# EAGLE schematic transceiver_and_pulse_generators (EAGLE 9.1.3)

## Sheet 1 of 2
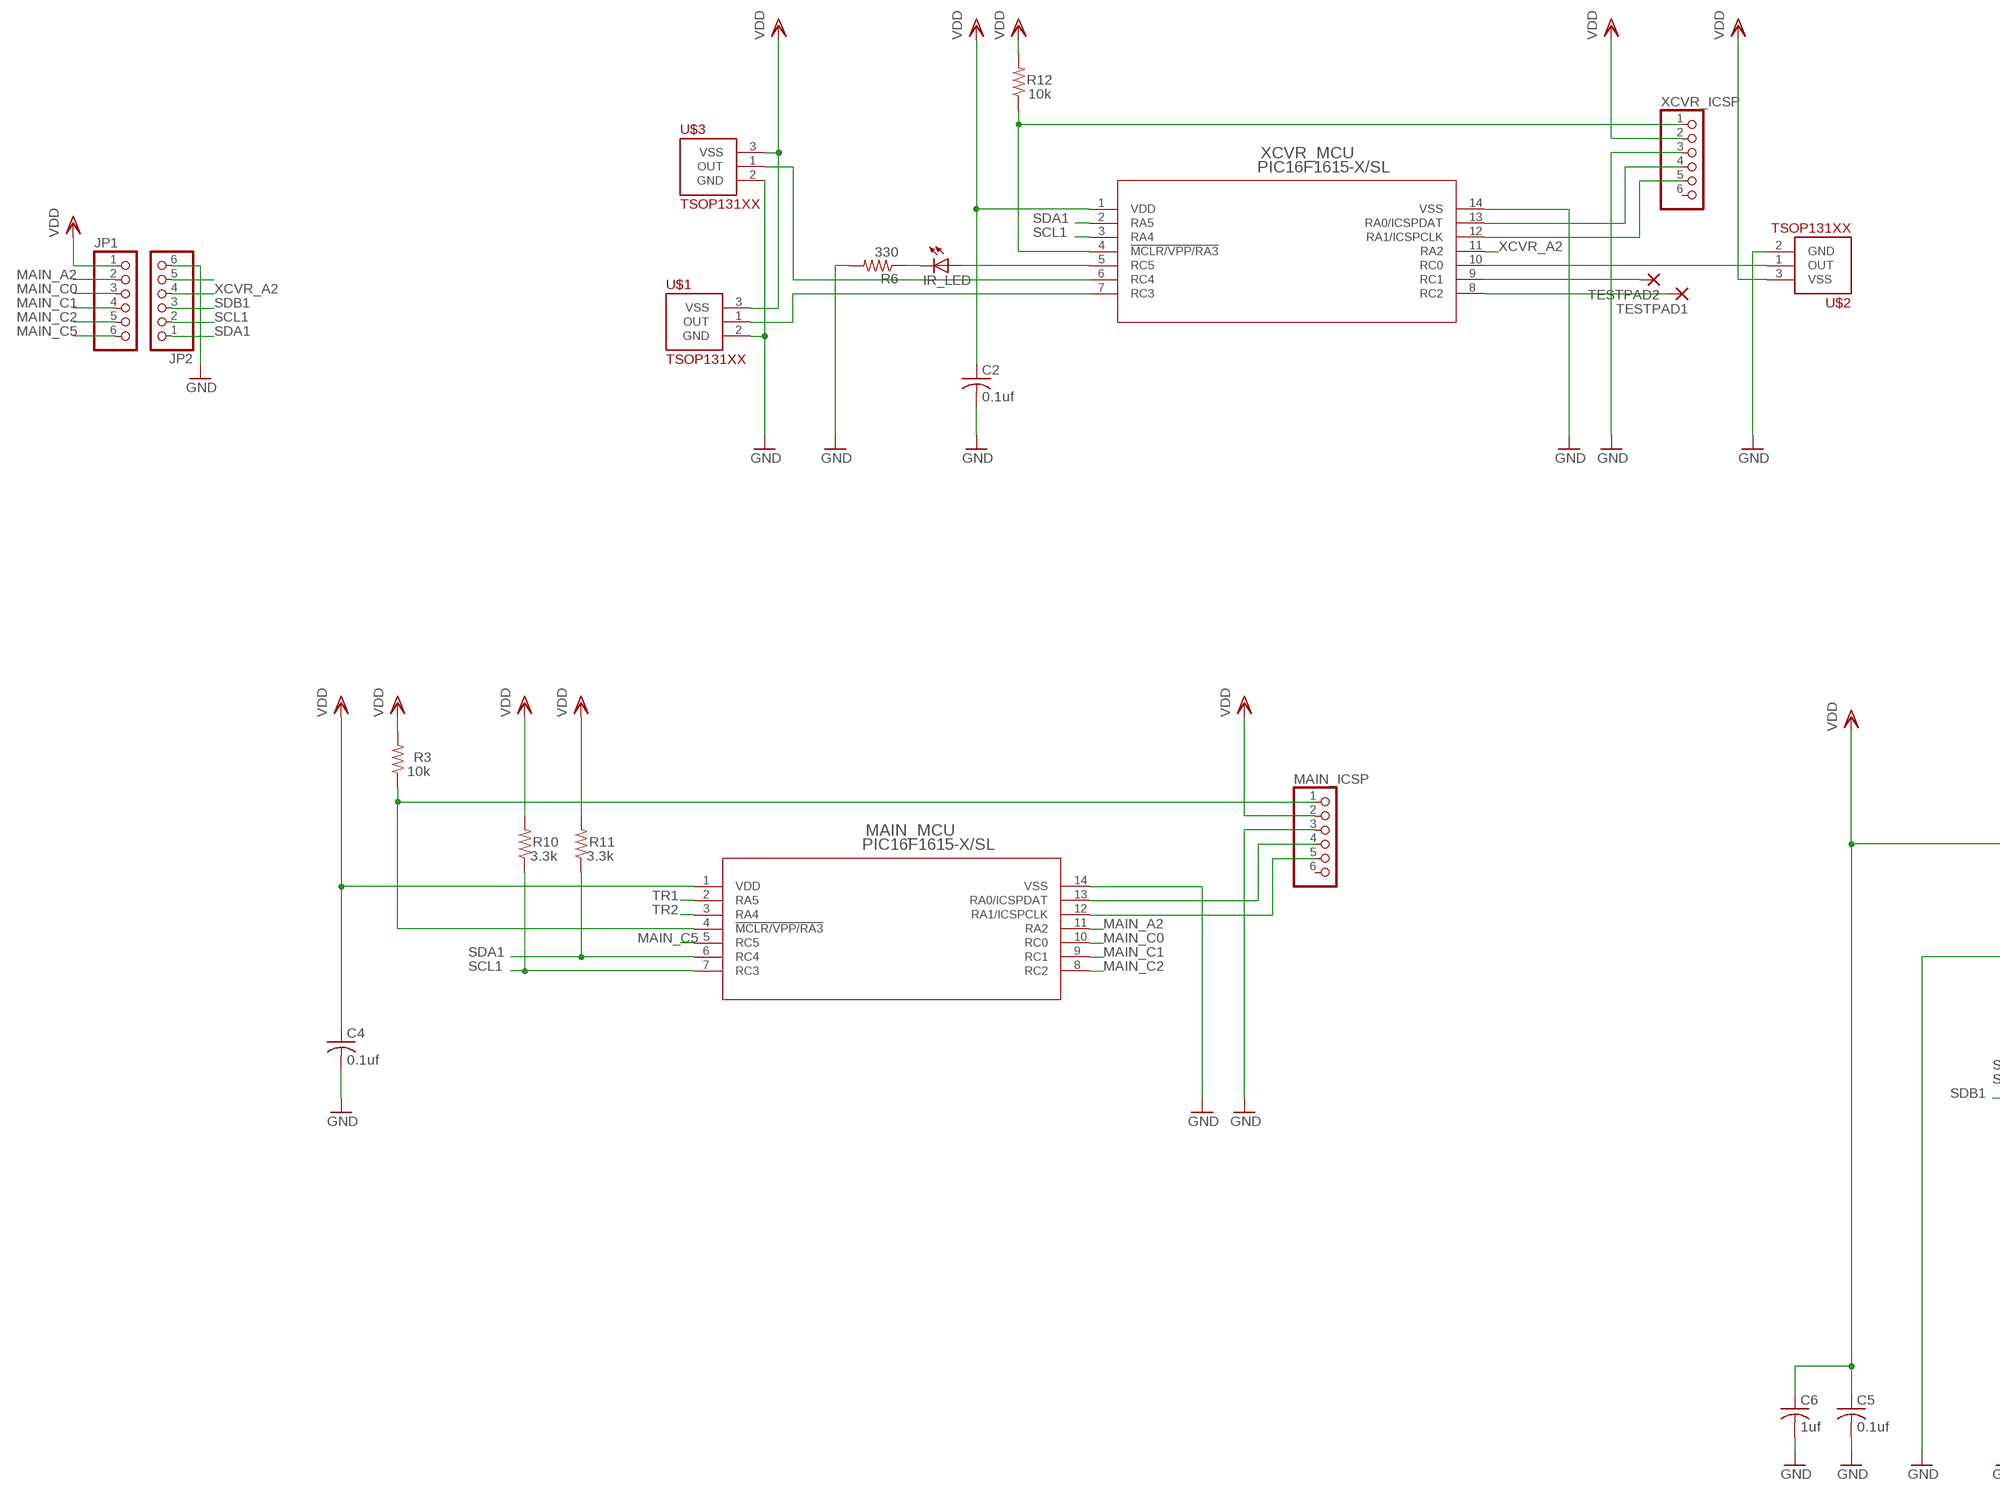
[diagram p0: schematic, sheet 1, part 1 of 2]
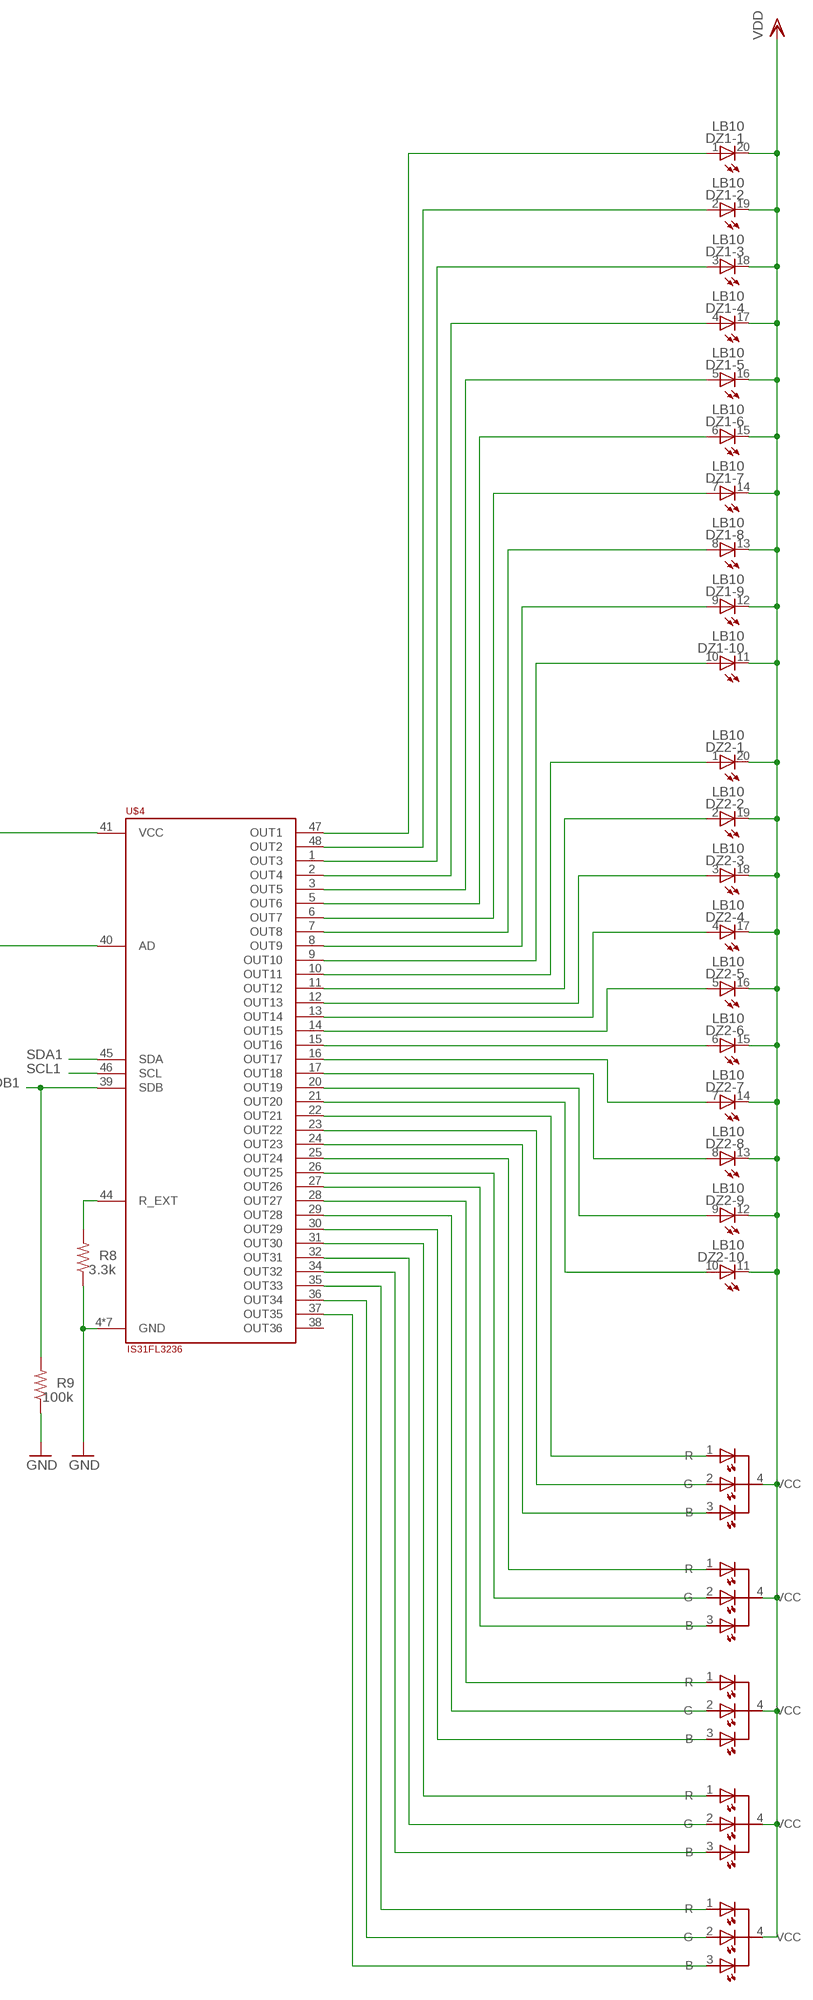
[diagram p1: schematic, sheet 1, part 2 of 2]

### Parts
C2  0.1uf  C-USC0603  [C0603]
C4  0.1uf  C-USC0603  [C0603]
C5  0.1uf  C-USC0603  [C0603]
C6  1uf  C-USC0603  [C0603]
DZ1  LB10  [LB10]
DZ2  LB10  [LB10]
IR_LED  LED5MM  [LED5MM]
JP1  PINHD-1X6  [1X06]
JP2  PINHD-1X6  [1X06]
MAIN_ICSP  PINHD-1X6  [1X06]
MAIN_MCU  PIC16F1615-X/SL  [SOIC14_SL]
R3  10k  R-US_R0603  [R0603]
R6  330  R-US_R0603  [R0603]
R8  3.3k  R-US_R0603  [R0603]
R9  100k  R-US_R0603  [R0603]
R10  3.3k  R-US_R0603  [R0603]
R11  3.3k  R-US_R0603  [R0603]
R12  10k  R-US_R0603  [R0603]
TESTPAD1  SMD2  [SMD1,27-2,54]
TESTPAD2  SMD2  [SMD1,27-2,54]
U$1  TSOP131XX  [TSOP13XXX]
U$2  TSOP131XX  [TSOP13XXX]
U$3  TSOP131XX  [TSOP13XXX]
U$4  IS31FL3236  [IS31FL3236]
U$5  LTST-C19HE1WT  [LTST-C19HE1WT]
U$6  LTST-C19HE1WT  [LTST-C19HE1WT]
U$7  LTST-C19HE1WT  [LTST-C19HE1WT]
U$8  LTST-C19HE1WT  [LTST-C19HE1WT]
U$9  LTST-C19HE1WT  [LTST-C19HE1WT]
XCVR_ICSP  PINHD-1X6  [1X06]
XCVR_MCU  PIC16F1615-X/SL  [SOIC14_SL]

### Nets
GND: C2.2 C4.2 C5.2 C6.2 JP2.6 MAIN_ICSP.3 MAIN_MCU.14(VSS) R6.2 R8.1 R9.1 U$1.2(GND) U$2.2(GND) U$3.2(GND) U$4.4(GND) U$4.18(GND) U$4.19(GND) U$4.33(GND) U$4.40(AD) U$4.42(GND) U$4.43(GND) U$4.49(GND) XCVR_ICSP.3 XCVR_MCU.14(VSS) ; also sheet 2
MAIN_A2: JP1.2 MAIN_MCU.11(RA2)
MAIN_C0: JP1.3 MAIN_MCU.10(RC0)
MAIN_C1: JP1.4 MAIN_MCU.9(RC1)
MAIN_C2: JP1.5 MAIN_MCU.8(RC2)
MAIN_C5: JP1.6 MAIN_MCU.5(RC5)
N$4: XCVR_ICSP.5 XCVR_MCU.12(RA1/ICSPCLK)
N$5: XCVR_ICSP.4 XCVR_MCU.13(RA0/ICSPDAT)
N$6: R12.1 XCVR_ICSP.1 XCVR_MCU.4(!MCLR/VPP/RA3)
N$12: IR_LED.A XCVR_MCU.5(RC5)
N$13: IR_LED.K(C) R6.1
N$14: MAIN_ICSP.1 MAIN_MCU.4(!MCLR/VPP/RA3) R3.1
N$15: MAIN_ICSP.5 MAIN_MCU.12(RA1/ICSPCLK)
N$16: MAIN_ICSP.4 MAIN_MCU.13(RA0/ICSPDAT)
N$17: U$1.1(OUT) XCVR_MCU.7(RC3)
N$18: U$2.1(OUT) XCVR_MCU.10(RC0)
N$19: U$3.1(OUT) XCVR_MCU.6(RC4)
N$20: DZ1.1(-1:A) U$4.47(OUT1)
N$21: DZ1.2(-2:A) U$4.48(OUT2)
N$22: DZ1.3(-3:A) U$4.1(OUT3)
N$23: DZ1.4(-4:A) U$4.2(OUT4)
N$24: DZ1.5(-5:A) U$4.3(OUT5)
N$25: DZ1.6(-6:A) U$4.5(OUT6)
N$26: DZ1.7(-7:A) U$4.6(OUT7)
N$27: DZ1.8(-8:A) U$4.7(OUT8)
N$28: DZ1.9(-9:A) U$4.8(OUT9)
N$29: DZ1.10(-10:A) U$4.9(OUT10)
N$30: DZ2.1(-1:A) U$4.10(OUT11)
N$31: DZ2.2(-2:A) U$4.11(OUT12)
N$32: DZ2.3(-3:A) U$4.12(OUT13)
N$33: DZ2.4(-4:A) U$4.13(OUT14)
N$34: DZ2.5(-5:A) U$4.14(OUT15)
N$35: U$4.37(OUT35) U$9.3(B)
N$36: U$4.36(OUT34) U$9.2(G)
N$37: U$4.35(OUT33) U$9.1(R)
N$38: U$4.34(OUT32) U$8.3(B)
N$39: U$4.32(OUT31) U$8.2(G)
N$40: U$4.31(OUT30) U$8.1(R)
N$41: U$4.30(OUT29) U$7.3(B)
N$42: U$4.29(OUT28) U$7.2(G)
N$43: U$4.28(OUT27) U$7.1(R)
N$44: U$4.27(OUT26) U$6.3(B)
N$45: U$4.26(OUT25) U$6.2(G)
N$46: U$4.25(OUT24) U$6.1(R)
N$47: U$4.24(OUT23) U$5.3(B)
N$48: U$4.23(OUT22) U$5.2(G)
N$49: U$4.22(OUT21) U$5.1(R)
N$50: DZ2.10(-10:A) U$4.21(OUT20)
N$51: DZ2.9(-9:A) U$4.20(OUT19)
N$52: DZ2.8(-8:A) U$4.17(OUT18)
N$53: DZ2.7(-7:A) U$4.16(OUT17)
N$54: DZ2.6(-6:A) U$4.15(OUT16)
N$55: R8.2 U$4.44(R_EXT)
N$62: JP2.5
RESERVED1: TESTPAD1.1(P) XCVR_MCU.8(RC2)
RESERVED2: TESTPAD2.1(P) XCVR_MCU.9(RC1)
SCL1: JP2.2 MAIN_MCU.7(RC3) R10.1 U$4.46(SCL) XCVR_MCU.3(RA4)
SDA1: JP2.1 MAIN_MCU.6(RC4) R11.1 U$4.45(SDA) XCVR_MCU.2(RA5)
SDB1: JP2.3 R9.2 U$4.39(SDB)
TR1: MAIN_MCU.2(RA5) ; also sheet 2
TR2: MAIN_MCU.3(RA4) ; also sheet 2
VDD: C2.1 C4.1 C5.1 C6.1 DZ1.11(-10:C) DZ1.12(-9:C) DZ1.13(-8:C) DZ1.14(-7:C) DZ1.15(-6:C) DZ1.16(-5:C) DZ1.17(-4:C) DZ1.18(-3:C) DZ1.19(-2:C) DZ1.20(-1:C) DZ2.11(-10:C) DZ2.12(-9:C) DZ2.13(-8:C) DZ2.14(-7:C) DZ2.15(-6:C) DZ2.16(-5:C) DZ2.17(-4:C) DZ2.18(-3:C) DZ2.19(-2:C) DZ2.20(-1:C) JP1.1 MAIN_ICSP.2 MAIN_MCU.1(VDD) R3.2 R10.2 R11.2 R12.2 U$1.3(VSS) U$2.3(VSS) U$3.3(VSS) U$4.41(VCC) U$5.4(VCC) U$6.4(VCC) U$7.4(VCC) U$8.4(VCC) U$9.4(VCC) XCVR_ICSP.2 XCVR_MCU.1(VDD) ; also sheet 2
XCVR_A2: JP2.4 XCVR_MCU.11(RA2)
Unconnected: MAIN_ICSP.6 U$4.38(OUT36) XCVR_ICSP.6

## Sheet 2 of 2
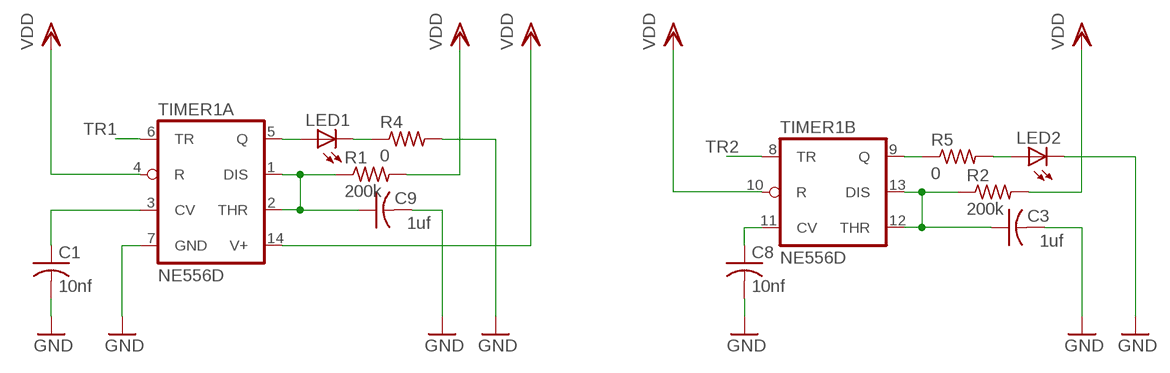
[diagram p2: schematic, sheet 2]

### Parts
C1  10nf  C-USC0603  [C0603]
C3  1uf  C-USC0603  [C0603]
C8  10nf  C-USC0603  [C0603]
C9  1uf  C-USC0603  [C0603]
LED1  LED5MM  [LED5MM]
LED2  LED5MM  [LED5MM]
R1  200k  R-US_R0603  [R0603]
R2  200k  R-US_R0603  [R0603]
R4  0  R-US_R0603  [R0603]
R5  0  R-US_R0603  [R0603]
TIMER1  NE556D  [SO14]

### Nets
GND: C1.2 C3.2 C8.2 C9.2 LED2.K(C) R4.2 TIMER1.7(A:GND) ; also sheet 1
N$1: C3.1 R2.1 TIMER1.12(B:THR) TIMER1.13(B:DIS)
N$2: C9.1 R1.1 TIMER1.1(A:DIS) TIMER1.2(A:THR)
N$3: C8.1 TIMER1.11(B:CV)
N$7: C1.1 TIMER1.3(A:CV)
N$8: LED1.A TIMER1.5(A:Q)
N$9: LED1.K(C) R4.1
N$10: R5.1 TIMER1.9(B:Q)
N$11: LED2.A R5.2
TR1: TIMER1.6(A:TR) ; also sheet 1
TR2: TIMER1.8(B:TR) ; also sheet 1
VDD: R1.2 R2.2 TIMER1.4(A:R) TIMER1.10(B:R) TIMER1.14(A:V+) ; also sheet 1

## Library data of the parts
C1-C6 C8 C9 = resistor:C-US: CAPACITOR, American symbol
DZ1 DZ2 = led:LB10: LED BLOCK 10-LED bar graph, DIL, Siemens
IR_LED LED1 LED2 = led:LED: LED OSRAM: - CHIPLED LG R971, LG N971, LY N971, LG Q971, LY Q971, LO R971, LY R971 LH N974, LH R974 LS Q976, LO Q976, LY Q976 LO Q996 - Hyper CHIPLED LW Q18S LB Q993, LB Q99A, LB R99A - SideLED LS A670, LO A670, LY A670, LG A670, LP A670 LB A673, LV A673, LT A673, LW A673 LH A674 LY A675 LS A676, LA A676, LO A676, LY A676, LW A676 LS A679, LY A679, LG A679 - Hyper Micro SIDELED® LS Y876, LA Y876, LO Y876, LY Y876 LT Y87S - SmartLED LW L88C, LW L88S LB L89C, LB L89S, LG L890 LS L89K, LO L89K, LY L89K LS L896, LA L896, LO L896, LY L896 - TOPLED LS T670, LO T670, LY T670, LG T670, LP T670 LSG T670, LSP T670, LSY T670, LOP T670, LYG T670 LG T671, LOG T671, LSG T671 LB T673, LV T673, LT T673, LW T673 LH T674 LS T676, LA T676, LO T676, LY T676, LB T676, LH T676, LSB T676, LW T676 LB T67C, LV T67C, LT T67C, LS T67K, LO T67K, LY T67K, LW E67C LS E67B, LA E67B, LO E67B, LY E67B, LB E67C, LV E67C, LT E67C LW T67C LS T679, LY T679, LG T679 LS T770, LO T770, LY T770, LG T770, LP T770 LB T773, LV T773, LT T773, LW T773 LH T774 LS E675, LA E675, LY E675, LS T675 LS T776, LA T776, LO T776, LY T776, LB T776 LHGB T686 LT T68C, LB T68C - Hyper Mini TOPLED® LB M676 - Mini TOPLED Santana® LG M470 LS M47K, LO M47K, LY M47K Source: http://www.osram.convergy.de LUXEON: - LUMILED® LXK2-PW12-R00, LXK2-PW12-S00, LXK2-PW14-U00, LXK2-PW14-V00 LXK2-PM12-R00, LXK2-PM12-S00, LXK2-PM14-U00 LXK2-PE12-Q00, LXK2-PE12-R00, LXK2-PE12-S00, LXK2-PE14-T00, LXK2-PE14-U00 LXK2-PB12-K00, LXK2-PB12-L00, LXK2-PB12-M00, LXK2-PB14-N00, LXK2-PB14-P00, LXK2-PB14-Q00 LXK2-PR12-L00, LXK2-PR12-M00, LXK2-PR14-Q00, LXK2-PR14-R00 LXK2-PD12-Q00, LXK2-PD12-R00, LXK2-PD12-S00 LXK2-PH12-R00, LXK2-PH12-S00 LXK2-PL12-P00, LXK2-PL12-Q00, LXK2-PL12-R00 Source: www.luxeon.com KINGBRIGHT: KA-3528ASYC Source: www.kingbright.com
JP1 JP2 MAIN_ICSP XCVR_ICSP = pinhead:PINHD-1X6: PIN HEADER
MAIN_MCU XCVR_MCU = pic16f1615_SL:PIC16F1615-X/SL; MANUFACTURER_PART_NUMBER: pic16f1615xsl; VENDOR: Microchip
R1-R6 R8-R12 = resistor:R-US_: RESISTOR, American symbol
TESTPAD1 TESTPAD2 = wirepad:SMD2: SMD PAD
TIMER1 = linear:*556: Dual TIMER
U$1-U$3 = tsop:TSOP131XX
U$4 = issi:IS31FL3236
U$5-U$9 = liteon:LTST-C19HE1WT